# EAGLE design space_elevator (EAGLE 7.1.0)
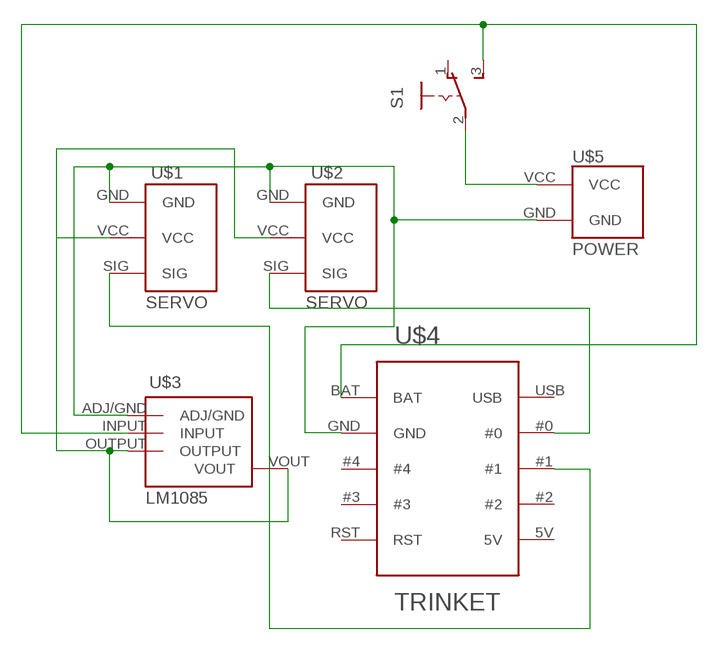
[diagram p0: schematic, sheet 1]

## Parts
S1  255SB  [255SB]
U$1  SERVO  [SERVO]
U$2  SERVO  [SERVO]
U$3  LM1085  [TO220H]
U$4  TRINKET  [TRINKETUSB]
U$5  POWER  [POWER]

## Nets
N$1: S1.2(P) U$5.VCC
N$2: S1.3(S) U$3.INPUT U$4.BAT
N$3: U$1.VCC U$2.VCC U$3.OUTPUT U$3.VOUT
N$4: U$1.GND U$2.GND U$3.ADJ/GND U$4.GND U$5.GND
N$9: U$2.SIG U$4.#0
N$10: U$1.SIG U$4.#1
Unconnected: S1.1(O) U$4.5V U$4.#2 U$4.#3 U$4.#4 U$4.RST U$4.USB

## Library data of the parts
S1 = switch:255SB: SLIDING SWITCH Distributor Buerklin, 11G810
U$1 U$2 = gabe:SERVO
U$3 = gabe:LM1085
U$4 = gabe:TRINKET
U$5 = gabe:POWER

## Board
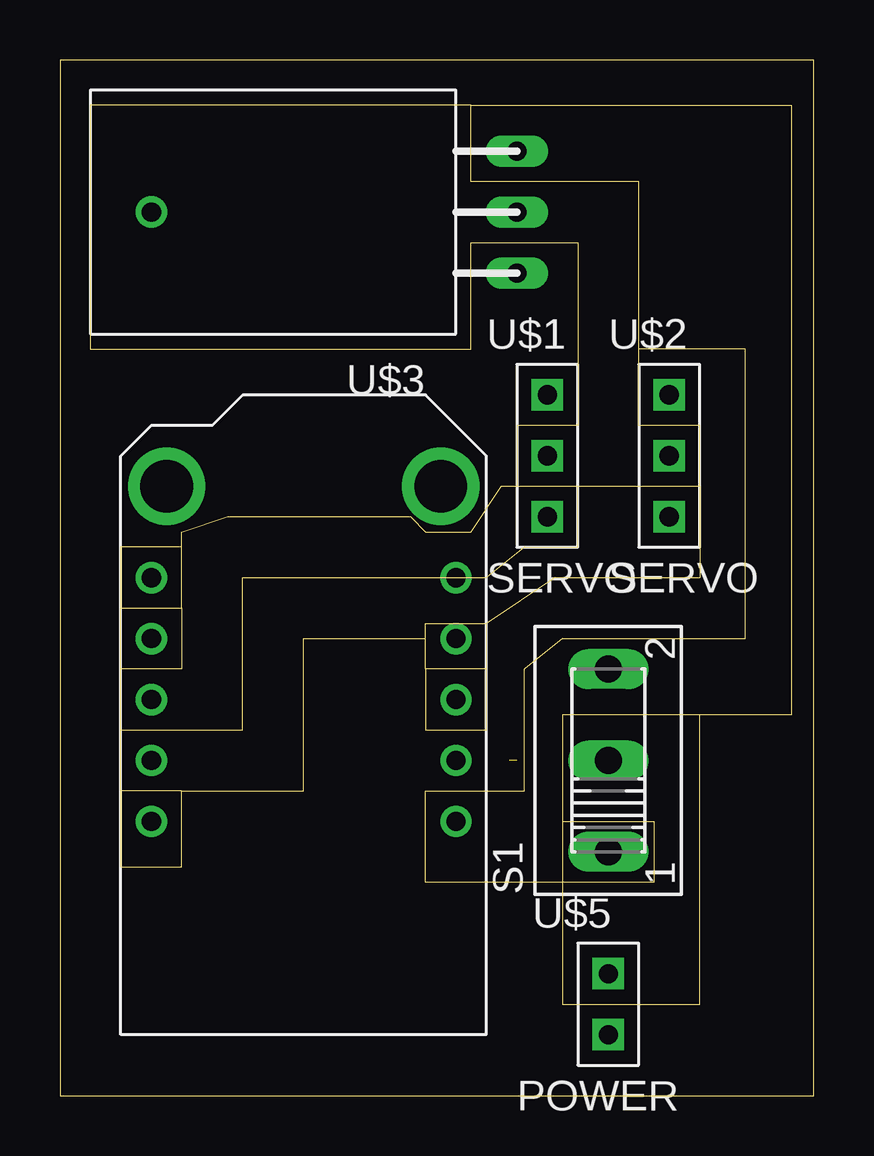
[diagram p1: board, top side]
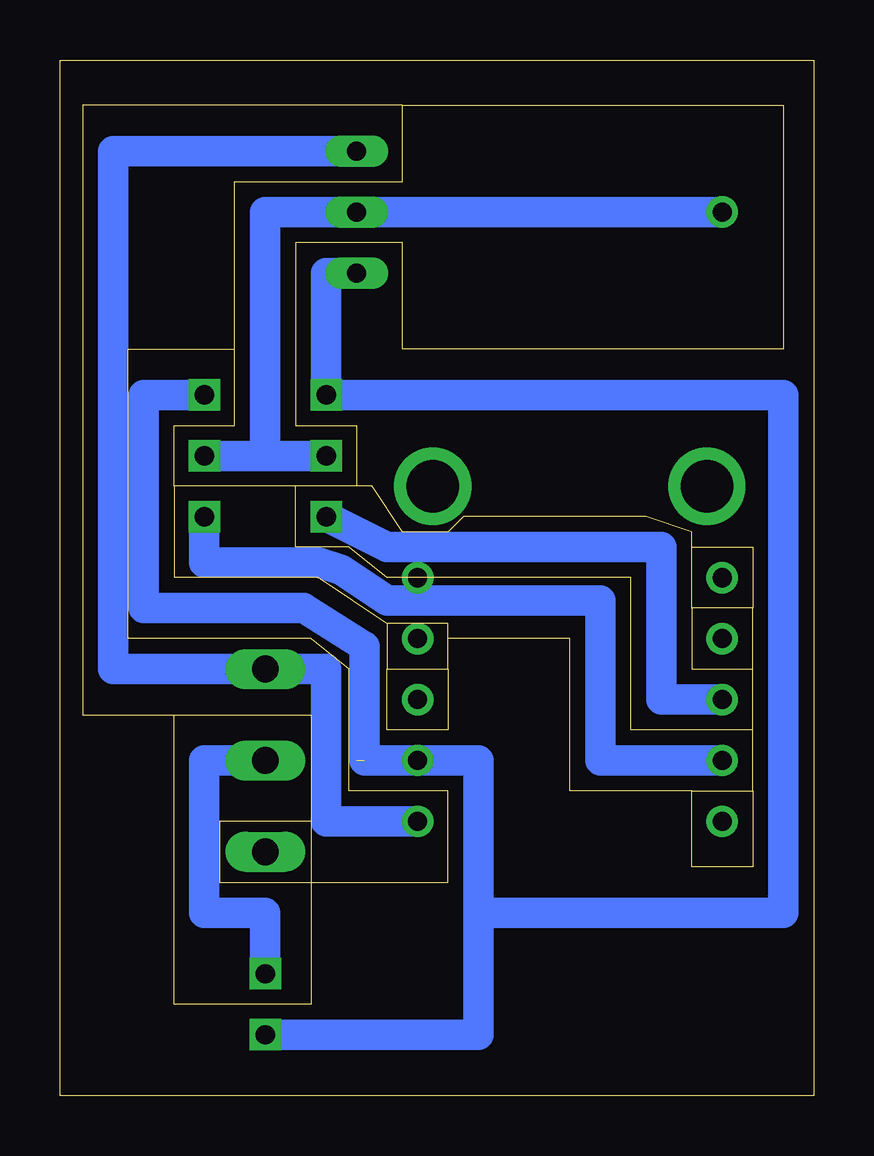
[diagram p2: board, bottom side, seen from below]

Size 31.42 x 43.17 mm. Coordinates in mm from the lower left corner, seen from the top.
Outline: 0,0 31.42,0 31.42,43.17 0,43.17 0,0
Copper layers (1*16): Top 0.035mm / dielectric 1.5mm / Bottom 0.035mm
Design rules "default": minimum track width 10mil, minimum drill 24mil, track to track 8mil, track to pad 8mil, pad to pad 8mil, via to via 8mil, smd to smd 8mil, copper to edge 40mil, drill to drill 8mil, minimum pad ring 10mil, minimum via ring 8mil, stop-mask expansion 4mil, vias tented up to drill 0mil, thermal gap 10mil
Milling: 76 lines

### Footprints (pad centres in the part's own frame; a part is rotated, then mirrored left to right if it is on the bottom)
255SB = drill 1.118 long: 1 -3.81,0; 2 0,0; 3 3.81,0
SERVO = drill 0.8 square: GND 0,2.54; SIG 0,-2.54; VCC 0,0
TO220H = drill 0.8 long: ADJ/GND -2.54,-2.54; INPUT 2.54,-2.54; OUTPUT 0,-2.54 | drill 0.8: VOUT 0,12.7
TRINKETUSB = drill 0.8: 5V 7.62,-1.27; #0 7.62,6.35; #1 7.62,3.81; #2 7.62,1.27; #3 -5.08,1.27; #4 -5.08,3.81; BAT -5.08,8.89; GND -5.08,6.35; RST -5.08,-1.27; USB 7.62,8.89 | drill 2.2: P$11 -4.445,-5.08; P$12 6.985,-5.08
POWER = drill 0.8 square: GND 0,0; VCC 0,2.54

### Placement (x,y rotation side)
S1  22.86,13.97 90 top
U$1  20.32,26.67 0 top
U$2  25.4,26.67 0 top
U$3  16.51,36.83 90 top
U$4  11.43,20.32 180 top
U$5  22.86,2.54 0 top

### Tracks (layer width: path | path; a pad name or v marks a point on that pad's centre or on a via)
N$1
  Bottom 1.27: U$5.VCC 22.86,7.62 25.4,7.62 25.4,13.97 S1.2
N$2
  Bottom 1.27: U$4.BAT 20.32,11.43 20.32,17.78 S1.3 29.21,17.78 29.21,39.37 U$3.INPUT
N$3
  Bottom 1.27: 22.86,26.67 22.86,36.83 U$3.OUTPUT U$3.VOUT | 22.86,26.67 U$2.VCC | U$1.VCC 22.86,26.67
N$4  (1 unrouted)
  Bottom 1.27: U$2.GND 27.94,29.21 27.94,20.32 21.27,20.32 18.73,18.73 18.73,13.97 U$4.GND 13.97,13.97 13.97,7.62 | 13.97,7.62 13.97,2.54 U$5.GND | 13.97,7.62 1.27,7.62 1.27,29.21 U$1.GND 20.32,34.29 U$3.ADJ/GND
N$9
  Bottom 1.27: U$4.#0 8.89,13.97 8.89,20.64 17.78,20.64 19.68,21.91 20.64,22.23 25.4,22.23 U$2.SIG
N$10
  Bottom 1.27: U$4.#1 6.35,16.51 6.35,22.86 17.78,22.86 U$1.SIG